# EAGLE schematic esp8266_temp_monitor (EAGLE 7.3.0)
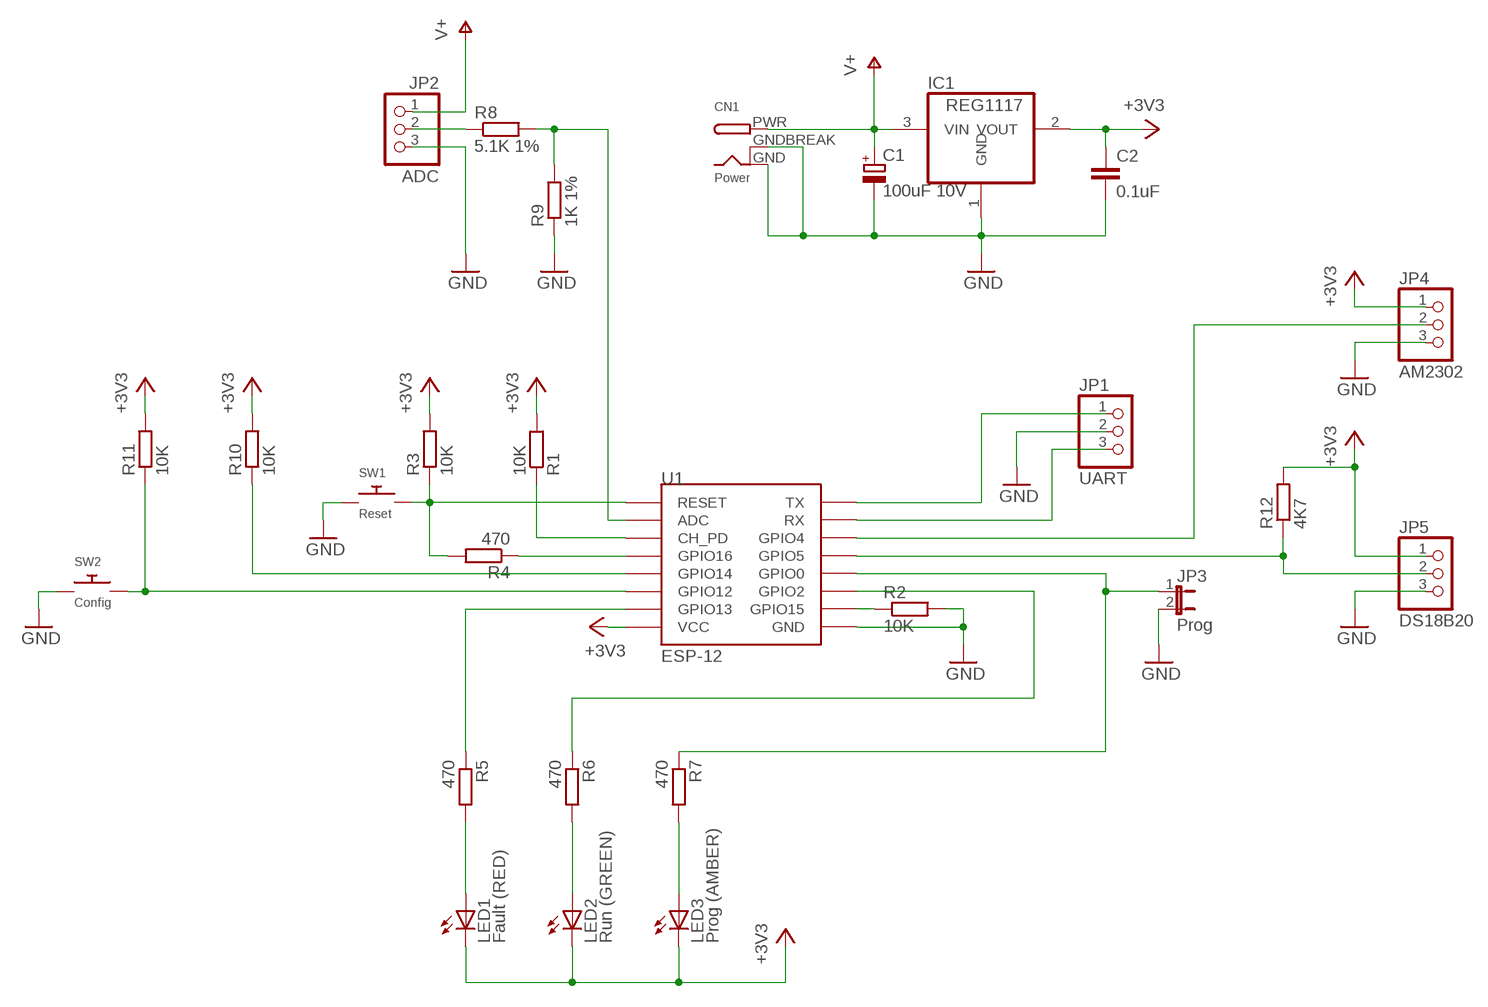
[diagram p0: schematic, sheet 1]

## Parts
C1  100uF 10V  CPOL-EUE/7260-38W  [E/7260-38W]
C2  0.1uF  C-EUC0805  [C0805]
CN1  Power  DCBARRELPTH  [DCJACK_2MM_PTH]
IC1  REG1117  [SOT223]
JP1  UART  PINHD-1X3  [1X03]
JP2  ADC  PINHD-1X3  [1X03]
JP3  Prog  JP1E  [JP1]
JP4  AM2302  PINHD-1X3  [1X03]
JP5  DS18B20  PINHD-1X3  [1X03]
LED1  Fault (RED)  LED5MM  [LED5MM]
LED2  Run (GREEN)  LED5MM  [LED5MM]
LED3  Prog (AMBER)  LED5MM  [LED5MM]
R1  10K  R-EU_R0805  [R0805]
R2  10K  R-EU_R0805  [R0805]
R3  10K  R-EU_M0805  [M0805]
R4  470  R-EU_M0805  [M0805]
R5  470  R-EU_M0805  [M0805]
R6  470  R-EU_M0805  [M0805]
R7  470  R-EU_M0805  [M0805]
R8  5.1K 1%  R-EU_M0805  [M0805]
R9  1K 1%  R-EU_M0805  [M0805]
R10  10K  R-EU_M0805  [M0805]
R11  10K  R-EU_M0805  [M0805]
R12  4K7  R-EU_M0805  [M0805]
SW1  Reset  SWITCH_PUSHBUTTONC&K_KSS  [BTN_CK_KSS]
SW2  Config  SWITCH_PUSHBUTTONC&K_KSS  [BTN_CK_KSS]
U1  ESP-12  ESP12SMD  [ESP12-SMD]

## Nets
+3V3: C2.1 IC1.2(VOUT) JP4.1 JP5.1 LED1.K(C) LED2.K(C) LED3.K(C) R1.2 R3.2 R10.2 R11.2 R12.2 U1.VCC
ADC_1V: R8.2 R9.2 U1.ADC
ADC_RAW: JP2.2 R8.1
CH_PD: R1.1 U1.CH_PD
GND: C1.- C2.2 CN1.GND CN1.GNDBREAK IC1.1(GND) JP1.2 JP2.3 JP3.2 JP4.3 JP5.3 R2.2 R9.1 SW1.P$1 SW2.P$1 U1.GND
GPIO0: JP3.1 R7.1 U1.GPIO0
GPIO2: R6.1 U1.GPIO2
GPIO4: JP4.2 U1.GPIO4
GPIO5: JP5.2 R12.1 U1.GPIO5
GPIO13: R5.1 U1.GPIO13
LED_FAULT: LED1.A R5.2
LED_OPERATE: LED2.A R6.2
LED_PROG: LED3.A R7.2
N$1: R4.1 U1.GPIO16
N$3: R2.1 U1.GPIO15
N$4: R10.1 U1.GPIO14
N$10: R11.1 SW2.P$2 U1.GPIO12
RESET: R3.1 R4.2 SW1.P$2 U1.RESET
RXD: JP1.3 U1.RXD0(RX)
TXD: JP1.1 U1.TXD0(TX)
V+: C1.+ CN1.PWR IC1.3(VIN) JP2.1

## Library data of the parts
C1 = rcl:CPOL-EU: POLARIZED CAPACITOR, European symbol
C2 = rcl:C-EU: CAPACITOR, European symbol
CN1 = adafruit:DCBARREL: 2.0mm DC Barrel Jack DCJACK_2MM_PTH - Through Hole Jack (4UConnector: 05537)
IC1 = burr-brown:REG1117: 800mA and 1A Low Dropout (LDO) Positive Regulator 1.8V, 2.5V, 2.85V, 3.3V, 5V, and Adj; MPN: REG1117; OC_FARNELL: 1097566; OC_NEWARK: 14P6981
JP1 JP2 JP4 JP5 = adafruit:PINHD-1X3: PIN HEADER
JP3 = jumper:JP1E: JUMPER
LED1-LED3 = led:LED: LED OSRAM: - CHIPLED LG R971, LG N971, LY N971, LG Q971, LY Q971, LO R971, LY R971 LH N974, LH R974 LS Q976, LO Q976, LY Q976 LO Q996 - Hyper CHIPLED LW Q18S LB Q993, LB Q99A, LB R99A - SideLED LS A670, LO A670, LY A670, LG A670, LP A670 LB A673, LV A673, LT A673, LW A673 LH A674 LY A675 LS A676, LA A676, LO A676, LY A676, LW A676 LS A679, LY A679, LG A679 - Hyper Micro SIDELED® LS Y876, LA Y876, LO Y876, LY Y876 LT Y87S - SmartLED LW L88C, LW L88S LB L89C, LB L89S, LG L890 LS L89K, LO L89K, LY L89K LS L896, LA L896, LO L896, LY L896 - TOPLED LS T670, LO T670, LY T670, LG T670, LP T670 LSG T670, LSP T670, LSY T670, LOP T670, LYG T670 LG T671, LOG T671, LSG T671 LB T673, LV T673, LT T673, LW T673 LH T674 LS T676, LA T676, LO T676, LY T676, LB T676, LH T676, LSB T676, LW T676 LB T67C, LV T67C, LT T67C, LS T67K, LO T67K, LY T67K, LW E67C LS E67B, LA E67B, LO E67B, LY E67B, LB E67C, LV E67C, LT E67C LW T67C LS T679, LY T679, LG T679 LS T770, LO T770, LY T770, LG T770, LP T770 LB T773, LV T773, LT T773, LW T773 LH T774 LS E675, LA E675, LY E675, LS T675 LS T776, LA T776, LO T776, LY T776, LB T776 LHGB T686 LT T68C, LB T68C - Hyper Mini TOPLED® LB M676 - Mini TOPLED Santana® LG M470 LS M47K, LO M47K, LY M47K Source: http://www.osram.convergy.de LUXEON: - LUMILED® LXK2-PW12-R00, LXK2-PW12-S00, LXK2-PW14-U00, LXK2-PW14-V00 LXK2-PM12-R00, LXK2-PM12-S00, LXK2-PM14-U00 LXK2-PE12-Q00, LXK2-PE12-R00, LXK2-PE12-S00, LXK2-PE14-T00, LXK2-PE14-U00 LXK2-PB12-K00, LXK2-PB12-L00, LXK2-PB12-M00, LXK2-PB14-N00, LXK2-PB14-P00, LXK2-PB14-Q00 LXK2-PR12-L00, LXK2-PR12-M00, LXK2-PR14-Q00, LXK2-PR14-R00 LXK2-PD12-Q00, LXK2-PD12-R00, LXK2-PD12-S00 LXK2-PH12-R00, LXK2-PH12-S00 LXK2-PL12-P00, LXK2-PL12-Q00, LXK2-PL12-R00 Source: www.luxeon.com KINGBRIGHT: KA-3528ASYC Source: www.kingbright.com
R1-R12 = resistor:R-EU_: RESISTOR, European symbol
SW1 SW2 = adafruit:SWITCH_PUSHBUTTON: Buttons SOFTTOUCHSMD_SJ - Soft touch temporary push button (Super Junk Akihabara) Compatible with SKPMANE010 [Mouser: 688-SKPMAN] C&K_KSS = Digikey: KSS221GLFS
U1 = esp8266modules:ESP12: ESP8266 Wifi module 12